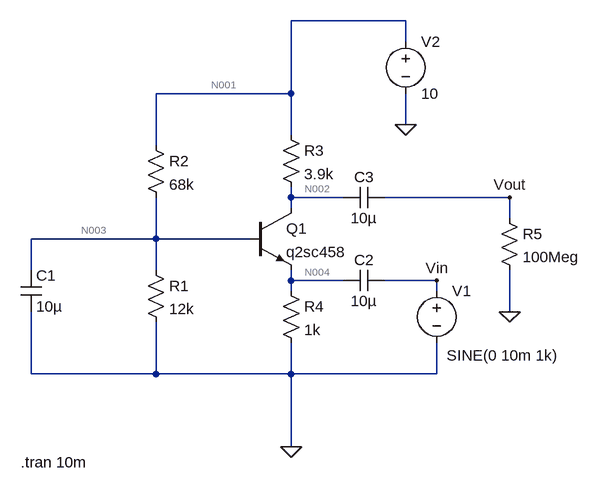
[diagram p0: schematic 1-3.asc]
1-3.asc, the LTspice schematic file:
Version 4
SHEET 1 884 680
WIRE 608 -192 432 -192
WIRE 608 -160 608 -192
WIRE 432 -80 432 -192
WIRE 432 -80 224 -80
WIRE 608 -32 608 -80
WIRE 432 -16 432 -80
WIRE 224 0 224 -80
WIRE 432 80 432 64
WIRE 512 80 432 80
WIRE 768 80 576 80
WIRE 432 96 432 80
WIRE 768 112 768 80
WIRE 224 144 224 80
WIRE 224 144 32 144
WIRE 368 144 224 144
WIRE 32 192 32 144
WIRE 224 192 224 144
WIRE 432 208 432 192
WIRE 512 208 432 208
WIRE 656 208 576 208
WIRE 432 224 432 208
WIRE 656 224 656 208
WIRE 768 256 768 192
WIRE 32 352 32 256
WIRE 224 352 224 272
WIRE 224 352 32 352
WIRE 432 352 432 304
WIRE 432 352 224 352
WIRE 656 352 656 304
WIRE 656 352 432 352
WIRE 432 464 432 352
FLAG 432 464 0
FLAG 608 -32 0
FLAG 768 256 0
FLAG 656 208 Vin
FLAG 768 80 Vout
SYMBOL cap 16 192 R0
SYMATTR InstName C1
SYMATTR Value 10µ
SYMBOL res 208 176 R0
SYMATTR InstName R1
SYMATTR Value 12k
SYMBOL res 208 -16 R0
SYMATTR InstName R2
SYMATTR Value 68k
SYMBOL res 416 -32 R0
SYMATTR InstName R3
SYMATTR Value 3.9k
SYMBOL npn 368 96 R0
SYMATTR InstName Q1
SYMATTR Value q2sc458
SYMBOL res 416 208 R0
SYMATTR InstName R4
SYMATTR Value 1k
SYMBOL cap 576 192 R90
WINDOW 0 0 32 VBottom 2
WINDOW 3 32 32 VTop 2
SYMATTR InstName C2
SYMATTR Value 10µ
SYMBOL voltage 656 208 R0
WINDOW 123 0 0 Left 0
WINDOW 39 0 0 Left 0
WINDOW 3 15 115 Left 2
SYMATTR InstName V1
SYMATTR Value SINE(0 10m 1k)
SYMBOL voltage 608 -176 R0
WINDOW 123 0 0 Left 0
WINDOW 39 0 0 Left 0
SYMATTR InstName V2
SYMATTR Value 10
SYMBOL cap 576 64 R90
WINDOW 0 0 32 VBottom 2
WINDOW 3 32 32 VTop 2
SYMATTR InstName C3
SYMATTR Value 10µ
SYMBOL res 752 96 R0
SYMATTR InstName R5
SYMATTR Value 100Meg
TEXT 16 488 Left 2 !.tran 10m

The netlist it stands for:
* 1-3.asc
C1 N003 0 10µ
R1 N003 0 12k
R2 N001 N003 68k
R3 N001 N002 3.9k
Q1 N002 N003 N004 0 q2sc458
R4 N004 0 1k
C2 Vin N004 10µ
V1 Vin 0 SINE(0 10m 1k)
V2 N001 0 10
C3 Vout N002 10µ
R5 Vout 0 100Meg
.model NPN NPN
.model PNP PNP
.lib standard.bjt
.tran 10m
.backanno
.end

* Results of the author's LTspice run, read from the files saved beside the schematic
* Operating Point, zero values left out:
*   V(n003) = 1.437 V
*   V(n001) = 10 V
*   V(n002) = 6.871 V
*   V(n004) = 808.5 mV
*   Ic(Q1) = 802.3 µA
*   Ib(Q1) = 6.14 µA
*   Ie(Q1) = -808.5 µA
*   I(R4) = 808.5 µA
*   I(R3) = 802.3 µA
*   I(R2) = 125.9 µA
*   I(R1) = 119.8 µA
*   I(V2) = -928.2 µA
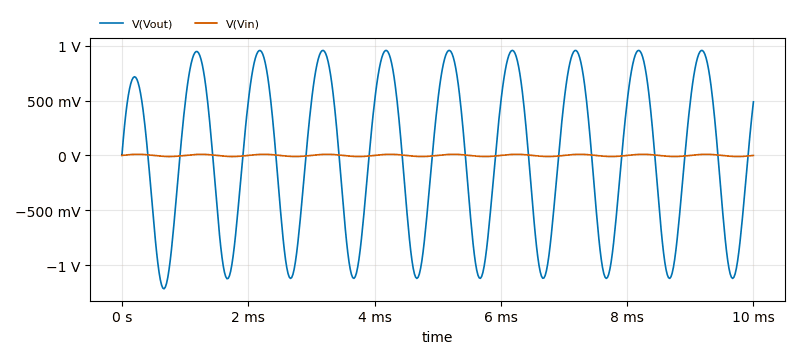
[diagram p1: Transient Analysis of 1-3.asc, plotted from the saved traces]
* Transient Analysis, 1 run:
*   V(Vout): min -1.214 V, max 956.5 mV, average -19.35 mV, rms 729.2 mV, last 488 mV
*   V(Vin): min -10 mV, max 10 mV, average 671.4 nV, rms 7.071 mV, last 0 V